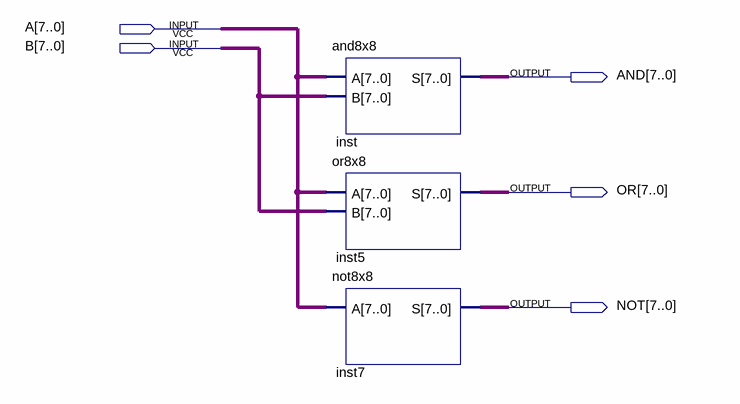
[diagram p0: schematic sheet]
// Quartus schematic test.bdf as structural Verilog: 3 symbols, 5 pins
module test (
  input  [7:0] A,
  input  [7:0] B,
  output [7:0] AND,
  output [7:0] OR,
  output [7:0] NOT
);

  and8x8 inst (.A(A), .B(B), .S(AND));
  or8x8 inst5 (.A(A), .B(B), .S(OR));
  not8x8 inst7 (.A(A), .S(NOT));
endmodule
